# Altium schematic sheet 33.DRAM-DDR4_2x16bit_96P.SchDoc
size 420 x 297 mm
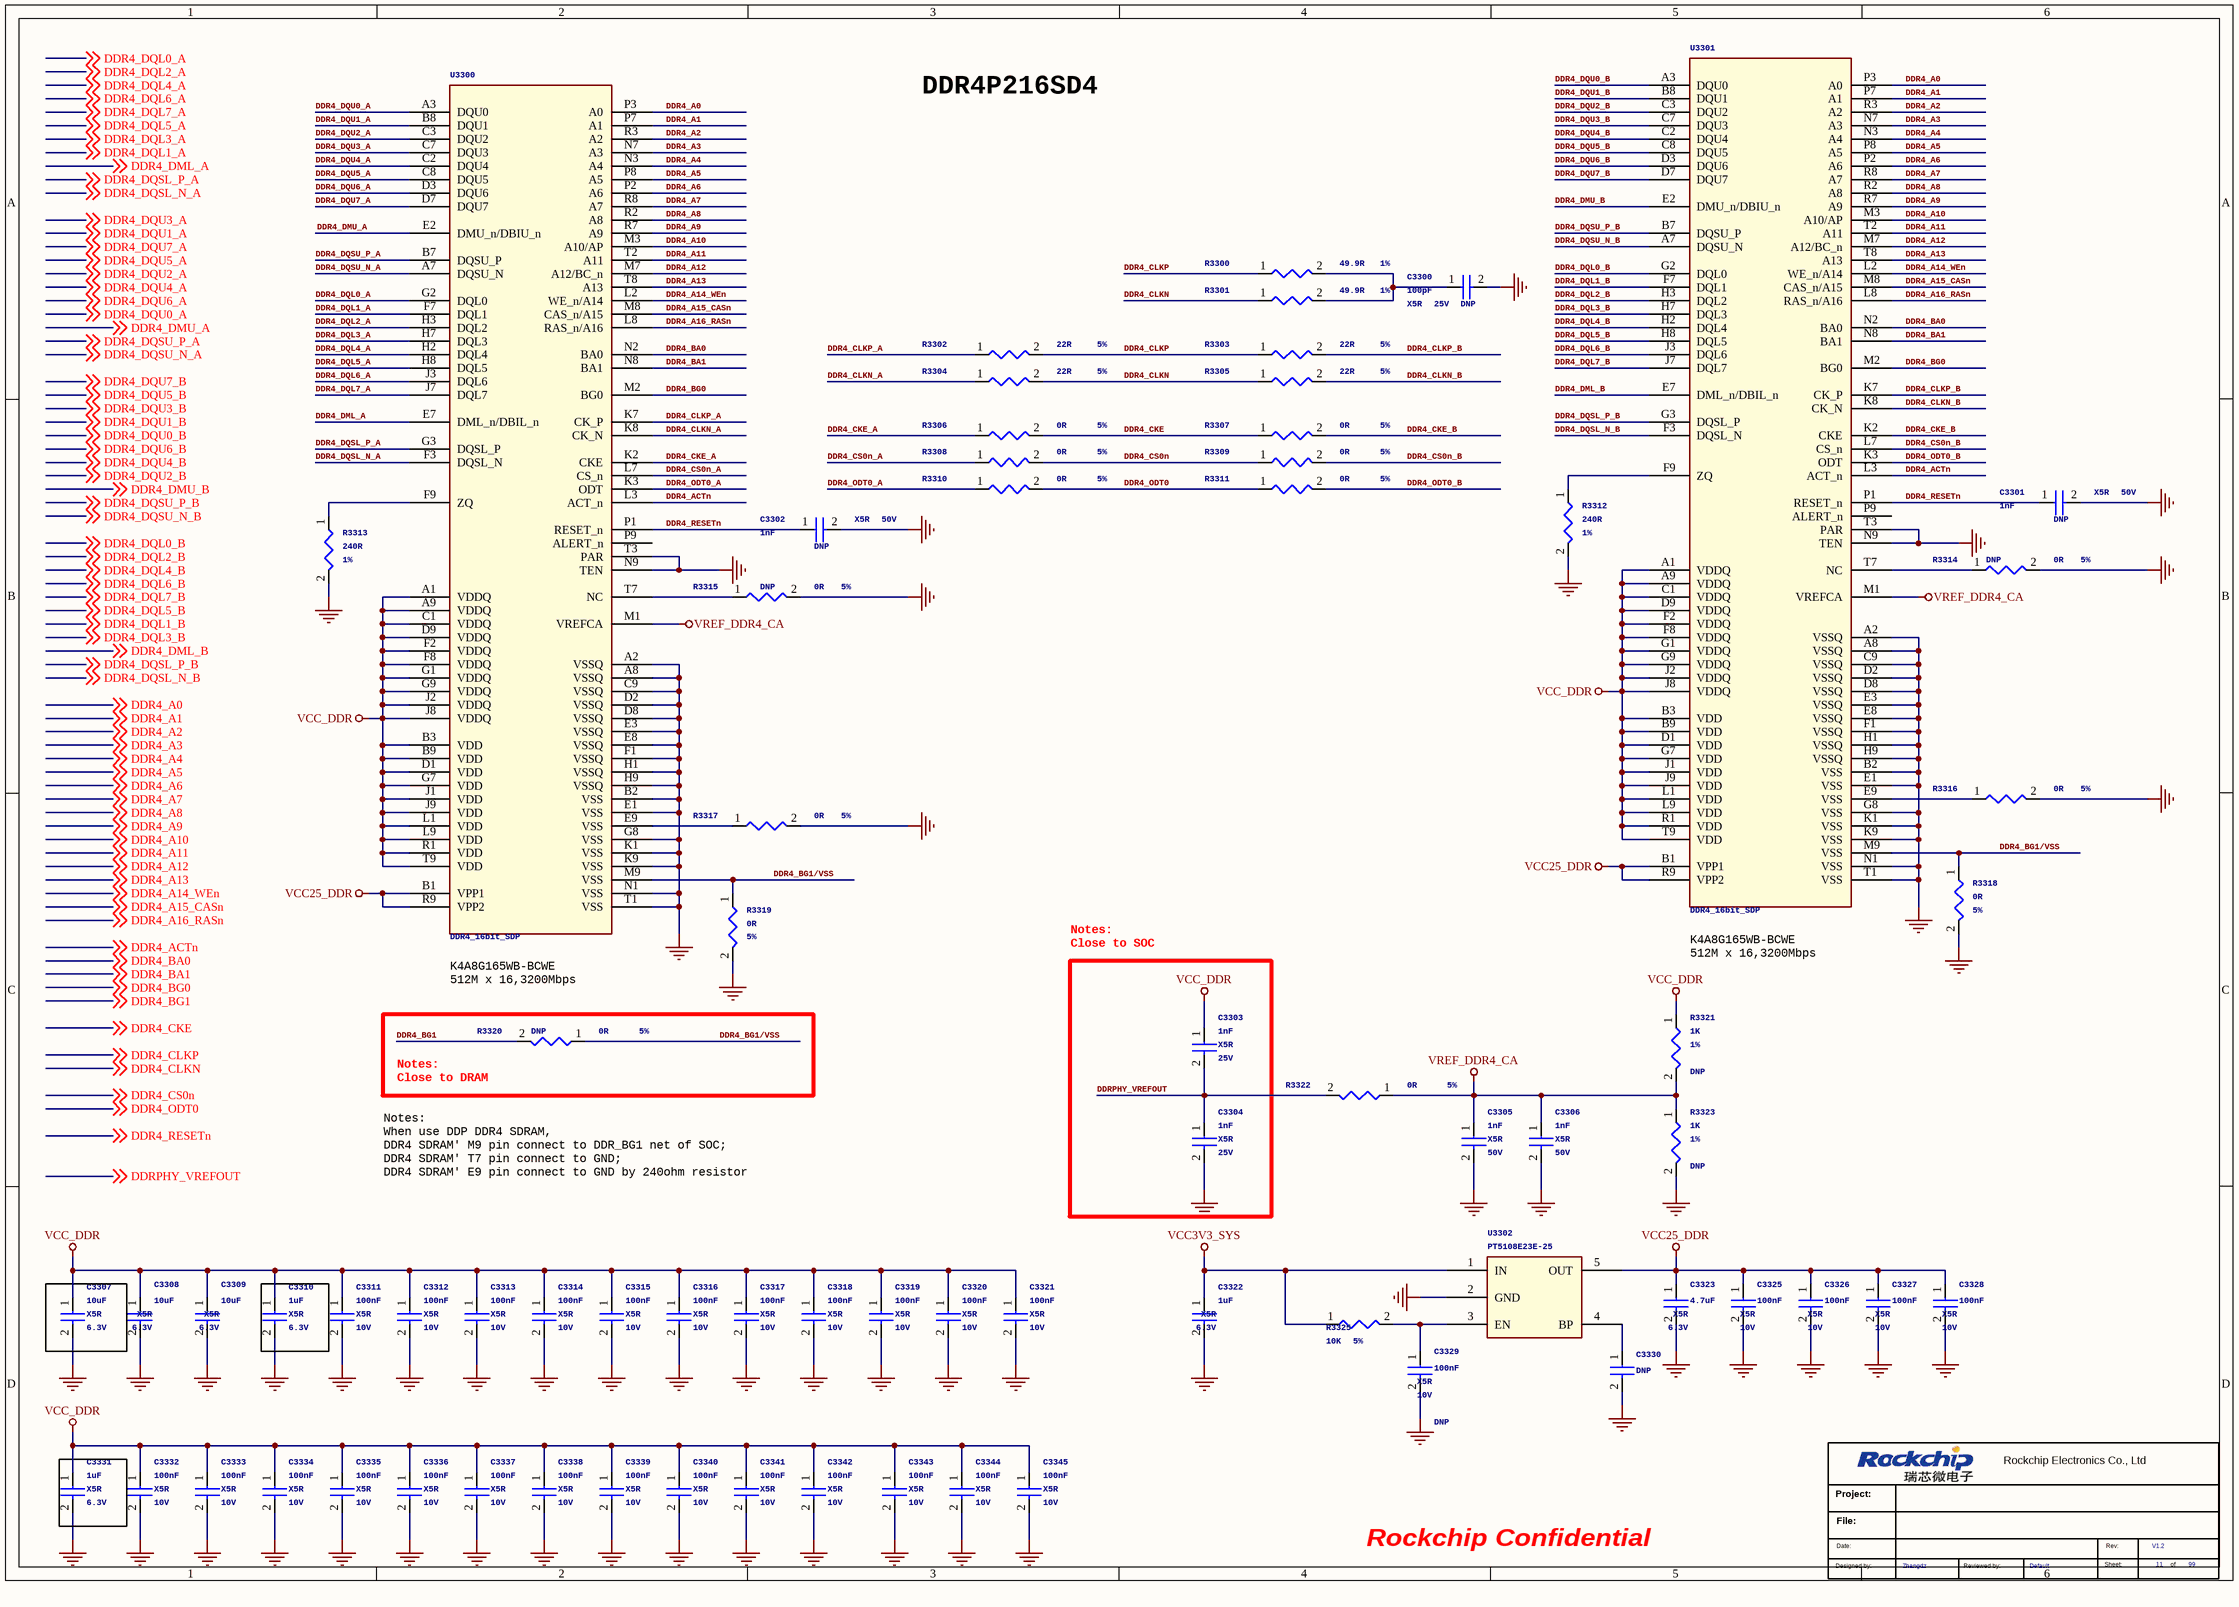
[diagram p0: 33.DRAM-DDR4_2x16bit_96P.SchDoc]

## Parts
*  Schematic Page Count: 99  Schematic Page Number: 11  Designer: Zhangdz  Revision: V1.2  Check: Default  (hidden comment: Rockchip_new)  (graphical)
C3300  100pF  Voltage: 25V  Dielectric: X5R  option: DNP  [C0201]
C3301  1nF  Voltage: 50V  Dielectric: X5R  option: DNP  [C0402]
C3302  1nF  Voltage: 50V  Dielectric: X5R  option: DNP  [C0402]
C3303  1nF  Voltage: 25V  Dielectric: X5R  [C0201]
C3304  1nF  Voltage: 25V  Dielectric: X5R  [C0201]
C3305  1nF  Voltage: 50V  Dielectric: X5R  [C0402]
C3306  1nF  Voltage: 50V  Dielectric: X5R  [C0402]
C3307  10uF  Voltage: 6.3V  Dielectric: X5R  [C0603]
C3308  10uF  Voltage: 6.3V  Dielectric: X5R  [C0603]
C3309  10uF  Voltage: 6.3V  Dielectric: X5R  [C0603]
C3310  1uF  Voltage: 6.3V  Dielectric: X5R  [C0402]
C3311  100nF  Voltage: 10V  Dielectric: X5R  [C0402]
C3312  100nF  Voltage: 10V  Dielectric: X5R  [C0402]
C3313  100nF  Voltage: 10V  Dielectric: X5R  [C0402]
C3314  100nF  Voltage: 10V  Dielectric: X5R  [C0402]
C3315  100nF  Voltage: 10V  Dielectric: X5R  [C0402]
C3316  100nF  Voltage: 10V  Dielectric: X5R  [C0402]
C3317  100nF  Voltage: 10V  Dielectric: X5R  [C0402]
C3318  100nF  Voltage: 10V  Dielectric: X5R  [C0402]
C3319  100nF  Voltage: 10V  Dielectric: X5R  [C0402]
C3320  100nF  Voltage: 10V  Dielectric: X5R  [C0402]
C3321  100nF  Voltage: 10V  Dielectric: X5R  [C0402]
C3322  1uF  Voltage: 6.3V  Dielectric: X5R  [C0402]
C3323  4.7uF  Voltage: 6.3V  Dielectric: X5R  [C0402]
C3325  100nF  Voltage: 10V  Dielectric: X5R  [C0402]
C3326  100nF  Voltage: 10V  Dielectric: X5R  [C0402]
C3327  100nF  Voltage: 10V  Dielectric: X5R  [C0402]
C3328  100nF  Voltage: 10V  Dielectric: X5R  [C0402]
C3329  100nF  Voltage: 10V  Dielectric: X5R  option: DNP  [C0402]
C3330  DNP  [C0402]
C3331  1uF  Voltage: 6.3V  Dielectric: X5R  [C0402]
C3332  100nF  Voltage: 10V  Dielectric: X5R  [C0402]
C3333  100nF  Voltage: 10V  Dielectric: X5R  [C0402]
C3334  100nF  Voltage: 10V  Dielectric: X5R  [C0402]
C3335  100nF  Voltage: 10V  Dielectric: X5R  [C0402]
C3336  100nF  Voltage: 10V  Dielectric: X5R  [C0402]
C3337  100nF  Voltage: 10V  Dielectric: X5R  [C0402]
C3338  100nF  Voltage: 10V  Dielectric: X5R  [C0402]
C3339  100nF  Voltage: 10V  Dielectric: X5R  [C0402]
C3340  100nF  Voltage: 10V  Dielectric: X5R  [C0402]
C3341  100nF  Voltage: 10V  Dielectric: X5R  [C0402]
C3342  100nF  Voltage: 10V  Dielectric: X5R  [C0402]
C3343  100nF  Voltage: 10V  Dielectric: X5R  [C0402]
C3344  100nF  Voltage: 10V  Dielectric: X5R  [C0402]
C3345  100nF  Voltage: 10V  Dielectric: X5R  [C0402]
R3300  49.9R  Tolerance: 1%  [R0201]
R3301  49.9R  Tolerance: 1%  [R0201]
R3302  22R  Tolerance: 5%  [R0201]
R3303  22R  Tolerance: 5%  [R0201]
R3304  22R  Tolerance: 5%  [R0201]
R3305  22R  Tolerance: 5%  [R0201]
R3306  0R  Tolerance: 5%  [R0201]
R3307  0R  Tolerance: 5%  [R0201]
R3308  0R  Tolerance: 5%  [R0201]
R3309  0R  Tolerance: 5%  [R0201]
R3310  0R  Tolerance: 5%  [R0201]
R3311  0R  Tolerance: 5%  [R0201]
R3312  240R  Tolerance: 1%  [R0402]
R3313  240R  Tolerance: 1%  [R0402]
R3314  0R  Tolerance: 5%  option: DNP  [R0402]
R3315  0R  Tolerance: 5%  option: DNP  [R0402]
R3316  0R  Tolerance: 5%  [R0402]
R3317  0R  Tolerance: 5%  [R0402]
R3318  0R  Tolerance: 5%  [R0402]
R3319  0R  Tolerance: 5%  [R0402]
R3320  0R  Tolerance: 5%  option: DNP  [R0402]
R3321  1K  Tolerance: 1%  option: DNP  [R0402]
R3322  0R  Tolerance: 5%  [R0402]
R3323  1K  Tolerance: 1%  option: DNP  [R0402]
R3325  10K  Tolerance: 5%  [R0402]
U3300  DDR4_16bit_SDP  [FBGA96_14R00X11R00X1R20]
U3301  DDR4_16bit_SDP  [FBGA96_14R00X11R00X1R20]
U3302  PT5108E23E-25  [SOT_23_5]

## Nets
GND: C3300.2 C3301.2 C3302.2 C3304.2 C3305.2 C3306.2 C3307.2 C3308.2 C3309.2 C3310.2 C3311.2 C3312.2 C3313.2 C3314.2 C3315.2 C3316.2 C3317.2 C3318.2 C3319.2 C3320.2 C3321.2 C3322.2 C3323.2 C3325.2 C3326.2 C3327.2 C3328.2 C3329.2 C3330.2 C3331.2 C3332.2 C3333.2 C3334.2 C3335.2 C3336.2 C3337.2 C3338.2 C3339.2 C3340.2 C3341.2 C3342.2 C3343.2 C3344.2 C3345.2 R3312.2 R3313.2 R3314.2 R3315.2 R3316.2 R3317.2 R3318.2 R3319.2 R3323.2 U3300.A2(VSSQ) U3300.A8(VSSQ) U3300.B2(VSS) U3300.C9(VSSQ) U3300.D2(VSSQ) U3300.D8(VSSQ) U3300.E1(VSS) U3300.E3(VSSQ) U3300.E8(VSSQ) U3300.F1(VSSQ) U3300.G8(VSS) U3300.H1(VSSQ) U3300.H9(VSSQ) U3300.K1(VSS) U3300.K9(VSS) U3300.N1(VSS) U3300.N9(TEN) U3300.T1(VSS) U3300.T3(PAR) U3301.A2(VSSQ) U3301.A8(VSSQ) U3301.B2(VSS) U3301.C9(VSSQ) U3301.D2(VSSQ) U3301.D8(VSSQ) U3301.E1(VSS) U3301.E3(VSSQ) U3301.E8(VSSQ) U3301.F1(VSSQ) U3301.G8(VSS) U3301.H1(VSSQ) U3301.H9(VSSQ) U3301.K1(VSS) U3301.K9(VSS) U3301.N1(VSS) U3301.N9(TEN) U3301.T1(VSS) U3301.T3(PAR) U3302.2(GND)
VCC3V3_SYS: C3322.1 R3325.1 U3302.1(IN)
VCC25_DDR: C3323.1 C3325.1 C3326.1 C3327.1 C3328.1 U3300.B1(VPP1) U3300.R9(VPP2) U3301.B1(VPP1) U3301.R9(VPP2) U3302.5(OUT)
VCC_DDR: C3303.1 C3307.1 C3308.1 C3309.1 C3310.1 C3311.1 C3312.1 C3313.1 C3314.1 C3315.1 C3316.1 C3317.1 C3318.1 C3319.1 C3320.1 C3321.1 C3331.1 C3332.1 C3333.1 C3334.1 C3335.1 C3336.1 C3337.1 C3338.1 C3339.1 C3340.1 C3341.1 C3342.1 C3343.1 C3344.1 C3345.1 R3321.1 U3300.A1(VDDQ) U3300.A9(VDDQ) U3300.B3(VDD) U3300.B9(VDD) U3300.C1(VDDQ) U3300.D1(VDD) U3300.D9(VDDQ) U3300.F2(VDDQ) U3300.F8(VDDQ) U3300.G1(VDDQ) U3300.G7(VDD) U3300.G9(VDDQ) U3300.J1(VDD) U3300.J2(VDDQ) U3300.J8(VDDQ) U3300.J9(VDD) U3300.L1(VDD) U3300.L9(VDD) U3300.R1(VDD) U3300.T9(VDD) U3301.A1(VDDQ) U3301.A9(VDDQ) U3301.B3(VDD) U3301.B9(VDD) U3301.C1(VDDQ) U3301.D1(VDD) U3301.D9(VDDQ) U3301.F2(VDDQ) U3301.F8(VDDQ) U3301.G1(VDDQ) U3301.G7(VDD) U3301.G9(VDDQ) U3301.J1(VDD) U3301.J2(VDDQ) U3301.J8(VDDQ) U3301.J9(VDD) U3301.L1(VDD) U3301.L9(VDD) U3301.R1(VDD) U3301.T9(VDD)
VREF_DDR4_CA: C3305.1 C3306.1 R3321.2 R3322.1 R3323.1 U3300.M1(VREFCA) U3301.M1(VREFCA)
DDR4_A0: U3300.P3(A0) U3301.P3(A0) ; off-sheet DDR4_A0
DDR4_A1: U3300.P7(A1) U3301.P7(A1) ; off-sheet DDR4_A1
DDR4_A2: U3300.R3(A2) U3301.R3(A2) ; off-sheet DDR4_A2
DDR4_A3: U3300.N7(A3) U3301.N7(A3) ; off-sheet DDR4_A3
DDR4_A4: U3300.N3(A4) U3301.N3(A4) ; off-sheet DDR4_A4
DDR4_A5: U3300.P8(A5) U3301.P8(A5) ; off-sheet DDR4_A5
DDR4_A6: U3300.P2(A6) U3301.P2(A6) ; off-sheet DDR4_A6
DDR4_A7: U3300.R8(A7) U3301.R8(A7) ; off-sheet DDR4_A7
DDR4_A8: U3300.R2(A8) U3301.R2(A8) ; off-sheet DDR4_A8
DDR4_A9: U3300.R7(A9) U3301.R7(A9) ; off-sheet DDR4_A9
DDR4_A10: U3300.M3(A10/AP) U3301.M3(A10/AP) ; off-sheet DDR4_A10
DDR4_A11: U3300.T2(A11) U3301.T2(A11) ; off-sheet DDR4_A11
DDR4_A12: U3300.M7(A12/BC_n) U3301.M7(A12/BC_n) ; off-sheet DDR4_A12
DDR4_A13: U3300.T8(A13) U3301.T8(A13) ; off-sheet DDR4_A13
DDR4_A14_WEn: U3300.L2(WE_n/A14) U3301.L2(WE_n/A14) ; off-sheet DDR4_A14_WEn
DDR4_A15_CASn: U3300.M8(CAS_n/A15) U3301.M8(CAS_n/A15) ; off-sheet DDR4_A15_CASn
DDR4_A16_RASn: U3300.L8(RAS_n/A16) U3301.L8(RAS_n/A16) ; off-sheet DDR4_A16_RASn
DDR4_ACTn: U3300.L3(ACT_n) U3301.L3(ACT_n) ; off-sheet DDR4_ACTn
DDR4_BA0: U3300.N2(BA0) U3301.N2(BA0) ; off-sheet DDR4_BA0
DDR4_BA1: U3300.N8(BA1) U3301.N8(BA1) ; off-sheet DDR4_BA1
DDR4_BG0: U3300.M2(BG0) U3301.M2(BG0) ; off-sheet DDR4_BG0
DDR4_BG1: R3320.2 ; off-sheet DDR4_BG1
DDR4_BG1/VSS: R3318.1 R3319.1 R3320.1 U3300.M9(VSS) U3301.M9(VSS)
DDR4_CKE: R3306.2 R3307.1 ; off-sheet DDR4_CKE
DDR4_CKE_A: R3306.1 U3300.K2(CKE)
DDR4_CKE_B: R3307.2 U3301.K2(CKE)
DDR4_CLKN: R3301.1 R3304.2 R3305.1 ; off-sheet DDR4_CLKN
DDR4_CLKN_A: R3304.1 U3300.K8(CK_N)
DDR4_CLKN_B: R3305.2 U3301.K8(CK_N)
DDR4_CLKP: R3300.1 R3302.2 R3303.1 ; off-sheet DDR4_CLKP
DDR4_CLKP_A: R3302.1 U3300.K7(CK_P)
DDR4_CLKP_B: R3303.2 U3301.K7(CK_P)
DDR4_CS0n: R3308.2 R3309.1 ; off-sheet DDR4_CS0n
DDR4_CS0n_A: R3308.1 U3300.L7(CS_n)
DDR4_CS0n_B: R3309.2 U3301.L7(CS_n)
DDR4_DML_A: U3300.E7(DML_n/DBIL_n) ; off-sheet DDR4_DML_A
DDR4_DML_B: U3301.E7(DML_n/DBIL_n) ; off-sheet DDR4_DML_B
DDR4_DMU_A: U3300.E2(DMU_n/DBIU_n) ; off-sheet DDR4_DMU_A
DDR4_DMU_B: U3301.E2(DMU_n/DBIU_n) ; off-sheet DDR4_DMU_B
DDR4_DQL0_A: U3300.G2(DQL0) ; off-sheet DDR4_DQL0_A
DDR4_DQL0_B: U3301.G2(DQL0) ; off-sheet DDR4_DQL0_B
DDR4_DQL1_A: U3300.F7(DQL1) ; off-sheet DDR4_DQL1_A
DDR4_DQL1_B: U3301.F7(DQL1) ; off-sheet DDR4_DQL1_B
DDR4_DQL2_A: U3300.H3(DQL2) ; off-sheet DDR4_DQL2_A
DDR4_DQL2_B: U3301.H3(DQL2) ; off-sheet DDR4_DQL2_B
DDR4_DQL3_A: U3300.H7(DQL3) ; off-sheet DDR4_DQL3_A
DDR4_DQL3_B: U3301.H7(DQL3) ; off-sheet DDR4_DQL3_B
DDR4_DQL4_A: U3300.H2(DQL4) ; off-sheet DDR4_DQL4_A
DDR4_DQL4_B: U3301.H2(DQL4) ; off-sheet DDR4_DQL4_B
DDR4_DQL5_A: U3300.H8(DQL5) ; off-sheet DDR4_DQL5_A
DDR4_DQL5_B: U3301.H8(DQL5) ; off-sheet DDR4_DQL5_B
DDR4_DQL6_A: U3300.J3(DQL6) ; off-sheet DDR4_DQL6_A
DDR4_DQL6_B: U3301.J3(DQL6) ; off-sheet DDR4_DQL6_B
DDR4_DQL7_A: U3300.J7(DQL7) ; off-sheet DDR4_DQL7_A
DDR4_DQL7_B: U3301.J7(DQL7) ; off-sheet DDR4_DQL7_B
DDR4_DQSL_N_A: U3300.F3(DQSL_N) ; off-sheet DDR4_DQSL_N_A
DDR4_DQSL_N_B: U3301.F3(DQSL_N) ; off-sheet DDR4_DQSL_N_B
DDR4_DQSL_P_A: U3300.G3(DQSL_P) ; off-sheet DDR4_DQSL_P_A
DDR4_DQSL_P_B: U3301.G3(DQSL_P) ; off-sheet DDR4_DQSL_P_B
DDR4_DQSU_N_A: U3300.A7(DQSU_N) ; off-sheet DDR4_DQSU_N_A
DDR4_DQSU_N_B: U3301.A7(DQSU_N) ; off-sheet DDR4_DQSU_N_B
DDR4_DQSU_P_A: U3300.B7(DQSU_P) ; off-sheet DDR4_DQSU_P_A
DDR4_DQSU_P_B: U3301.B7(DQSU_P) ; off-sheet DDR4_DQSU_P_B
DDR4_DQU0_A: U3300.A3(DQU0) ; off-sheet DDR4_DQU0_A
DDR4_DQU0_B: U3301.A3(DQU0) ; off-sheet DDR4_DQU0_B
DDR4_DQU1_A: U3300.B8(DQU1) ; off-sheet DDR4_DQU1_A
DDR4_DQU1_B: U3301.B8(DQU1) ; off-sheet DDR4_DQU1_B
DDR4_DQU2_A: U3300.C3(DQU2) ; off-sheet DDR4_DQU2_A
DDR4_DQU2_B: U3301.C3(DQU2) ; off-sheet DDR4_DQU2_B
DDR4_DQU3_A: U3300.C7(DQU3) ; off-sheet DDR4_DQU3_A
DDR4_DQU3_B: U3301.C7(DQU3) ; off-sheet DDR4_DQU3_B
DDR4_DQU4_A: U3300.C2(DQU4) ; off-sheet DDR4_DQU4_A
DDR4_DQU4_B: U3301.C2(DQU4) ; off-sheet DDR4_DQU4_B
DDR4_DQU5_A: U3300.C8(DQU5) ; off-sheet DDR4_DQU5_A
DDR4_DQU5_B: U3301.C8(DQU5) ; off-sheet DDR4_DQU5_B
DDR4_DQU6_A: U3300.D3(DQU6) ; off-sheet DDR4_DQU6_A
DDR4_DQU6_B: U3301.D3(DQU6) ; off-sheet DDR4_DQU6_B
DDR4_DQU7_A: U3300.D7(DQU7) ; off-sheet DDR4_DQU7_A
DDR4_DQU7_B: U3301.D7(DQU7) ; off-sheet DDR4_DQU7_B
DDR4_ODT0: R3310.2 R3311.1 ; off-sheet DDR4_ODT0
DDR4_ODT0_A: R3310.1 U3300.K3(ODT)
DDR4_ODT0_B: R3311.2 U3301.K3(ODT)
DDR4_RESETn: C3301.1 C3302.1 U3300.P1(RESET_n) U3301.P1(RESET_n) ; off-sheet DDR4_RESETn
DDRPHY_VREFOUT: C3303.2 C3304.1 R3322.2 ; off-sheet DDRPHY_VREFOUT
NetC3300_1: C3300.1 R3300.2 R3301.2
NetC3329_1: C3329.1 R3325.2 U3302.3(EN)
NetC3330_1: C3330.1 U3302.4(BP)
NetR3312_1: R3312.1 U3301.F9(ZQ)
NetR3313_1: R3313.1 U3300.F9(ZQ)
NetR3314_1: R3314.1 U3301.T7(NC)
NetR3315_1: R3315.1 U3300.T7(NC)
NetR3316_1: R3316.1 U3301.E9(VSS)
NetR3317_1: R3317.1 U3300.E9(VSS)

Not connected (* = marked no-connect by the designer): U3300 P9(ALERT_n); U3301 P9(ALERT_n)

## Notes on the sheet
- DDR4P216SD4
- K4A8G165WB-BCWE
- 512M x 16,3200Mbps
- Notes:
  Close to SOC
- (near R3320) Notes:
  Close to DRAM
- Notes:
  When use DDP DDR4 SDRAM,
  DDR4 SDRAM' M9 pin connect to DDR_BG1 net of SOC;
  DDR4 SDRAM' T7 pin connect to GND;
  DDR4 SDRAM' E9 pin connect to GND by 240ohm resistor
- Rockchip Confidential
- (in symbol Rockchip_new) Rockchip Electronics Co., Ltd; Project:; File:; Date:; Rev:; Sheet:; of; Designed by:; Reviewed by:

## Library data of the parts
* = Rockchip_new: Page Number: 22; Page Count: 37; Revcode: V1.2
C3300 = CAP NP: cap,100.00pF,+/-10%,25V,X5R,C0201; Manufacturer PN: C0603X5R1E101K030BA; Manufacturer: TDK; C_Voltage: 6.3V; Tolerance: 10%; Priority: A; Number: 37; Created by: JJJ; Part Type: C0201; RK PN: C0603X5R1E101K030BA
C3301 C3302 C3305 = CAP NP: cap,1.00nF,+/-10%,50V,X5R,C0402; Manufacturer PN: C1005X5R1H102K050BA; Manufacturer: TDK; C_Voltage: 6.3V; Tolerance: 10%; Priority: A; Number: 37; Created by: JJJ; Part Type: C0402; RK PN: C1005X5R1H102K050BA
C3303 = CAP NP: cap,1.00nF,+/-10%,25V,X5R,C0201; Manufacturer PN: C0603X5R1E102K030BA; Manufacturer: TDK; C_Voltage: 6.3V; Tolerance: 10%; Priority: A; Number: 37; Created by: JJJ; Part Type: C0201; RK PN: C0603X5R1E102K030BA
C3304 = CAP NP: cap,1.00nF,+/-10%,25V,X5R,C0201; Manufacturer: TDK; Number: 37; RK PN: C0603X5R1E102K030BA; Priority: A; Tolerance: 10%; C_Voltage: 6.3V; Part Type: C0201; Manufacturer PN: C0603X5R1E102K030BA; Created by: JJJ
C3306 = CAP NP: cap,1.00nF,+/-10%,50V,X5R,C0402; Manufacturer: TDK; Number: 37; RK PN: C1005X5R1H102K050BA; Priority: A; Tolerance: 10%; C_Voltage: 6.3V; Part Type: C0402; Manufacturer PN: C1005X5R1H102K050BA; Created by: JJJ
C3307 C3308 = CAP NP: cap,10.00uF,+/-10%,6.3V,X5R,C0603; Manufacturer: TDK; RK PN: C1608X5R0J106K080AB; Priority: A; Tolerance: 10%; Part Type: C0603; C_Voltage: 6.3V; Manufacturer PN: C1608X5R0J106K080AB; Created by: JJJ
C3309 = CAP NP: cap,10.00uF,+/-10%,6.3V,X5R,C0603; Manufacturer PN: C1608X5R0J106K080AB; Manufacturer: TDK; Tolerance: 10%; Priority: A; Created by: JJJ; C_Voltage: 6.3V; Part Type: C0603; RK PN: C1608X5R0J106K080AB
C3310 C3331 = CAP NP: cap,1.00uF,+/-10%,6.3V,X5R,C0402; Manufacturer: TDK; Number: 37; RK PN: C1005X5R0J105K050BB; Priority: A; Tolerance: 10%; Part Type: C0402; Manufacturer PN: C1005X5R0J105K050BB; C_Voltage: 6.3V; Created by: JJJ
C3311 C3313-C3315 C3317 C3320 C3327 C3329 C3333 C3334 C3336 C3339 C3341 C3343 C3344 = CAP NP: cap,100.00nF,+/-10%,10V,X5R,C0402; Manufacturer PN: C1005X5R1A104K050BA; Manufacturer: TDK; C_Voltage: 6.3V; Tolerance: 10%; Priority: A; Number: 37; Created by: JJJ; Part Type: C0402; RK PN: C1005X5R1A104K050BA
C3312 C3316 C3318 C3319 C3321 C3325 C3326 C3328 C3332 C3335 C3337 C3338 C3340 C3342 C3345 = CAP NP: cap,100.00nF,+/-10%,10V,X5R,C0402; Manufacturer: TDK; Number: 37; RK PN: C1005X5R1A104K050BA; Priority: A; Tolerance: 10%; C_Voltage: 6.3V; Part Type: C0402; Manufacturer PN: C1005X5R1A104K050BA; Created by: JJJ
C3322 = CAP NP: cap,1.00uF,+/-10%,6.3V,X5R,C0402; Manufacturer PN: C1005X5R0J105K050BB; Manufacturer: TDK; Tolerance: 10%; Priority: A; Created by: JJJ; C_Voltage: 6.3V; Part Type: C0402; RK PN: C1005X5R0J105K050BB
C3323 = CAP NP: cap,4.70uF,+/-10%,6.3V,X5R,C0402; Manufacturer PN: C1005X5R0J475K050BC; Manufacturer: TDK; Tolerance: 10%; Priority: A; Number: 37; Created by: JJJ; C_Voltage: 6.3V; Part Type: C0402; RK PN: C1005X5R0J475K050BC
C3330 = CAP NP: Did Not Place.; RK PN: DNP0402; Priority: A; Part Type: DNP; Manufacturer PN: DNP0402; Created by: JJJ
R3300 = RESISTOR: 通用厚膜电阻,49R9,+/-1%,R0201,1/20W.; Manufacturer: YAGEO; RK PN: RC0201FR-0749R9L; Priority: A; Wattage: 1/20W; Part Type: 通用厚膜电阻; Manufacturer PN: RC0201FR-0749R9L; Created by: YTL
R3301 = RESISTOR: 通用厚膜电阻,49R9,+/-1%,R0201,1/20W.; Manufacturer PN: RC0201FR-0749R9L; Manufacturer: YAGEO; Wattage: 1/20W; Priority: A; Created by: YTL; Part Type: 通用厚膜电阻; RK PN: RC0201FR-0749R9L
R3302 R3303 = RESISTOR: 通用厚膜电阻,22R,+/-5%,R0201,1/20W.; Manufacturer PN: RC0201JR-0722RL; Manufacturer: YAGEO; Wattage: 1/20W; Priority: A; Created by: YTL; Part Type: 通用厚膜电阻; RK PN: RC0201JR-0722RL
R3304 R3305 = RESISTOR: 通用厚膜电阻,22R,+/-5%,R0201,1/20W.; Manufacturer: YAGEO; RK PN: RC0201JR-0722RL; Priority: A; Wattage: 1/20W; Part Type: 通用厚膜电阻; Manufacturer PN: RC0201JR-0722RL; Created by: YTL
R3306-R3311 = RESISTOR: 通用厚膜电阻,0R,+/-5%,R0201,1/20W.; Manufacturer: YAGEO; RK PN: RC0201JR-070RL; Priority: A; Wattage: 1/20W; Part Type: 通用厚膜电阻; Manufacturer PN: RC0201JR-070RL; Created by: YTL
R3312 = RESISTOR: 通用厚膜电阻,240R,+/-1%,R0402,1/16W.; Manufacturer PN: RC0402FR-07240RL; Manufacturer: YAGEO; Wattage: 1/16W; Priority: A; Created by: YTL; Part Type: 通用厚膜电阻; RK PN: RC0402FR-07240RL
R3313 = RESISTOR: 通用厚膜电阻,240R,+/-1%,R0402,1/16W.; Manufacturer: YAGEO; RK PN: RC0402FR-07240RL; Priority: A; Wattage: 1/16W; Part Type: 通用厚膜电阻; Manufacturer PN: RC0402FR-07240RL; Created by: YTL
R3314 R3317 R3319 = RESISTOR: 通用厚膜电阻,0R,+/-5%,R0402,1/16W.; Manufacturer PN: RC0402JR-070RL; Manufacturer: YAGEO; Wattage: 1/16W; Priority: A; Created by: YTL; Part Type: 通用厚膜电阻; RK PN: RC0402JR-070RL
R3315 R3316 R3318 R3320 R3322 = RESISTOR: 通用厚膜电阻,0R,+/-5%,R0402,1/16W.; Manufacturer: YAGEO; RK PN: RC0402JR-070RL; Priority: A; Wattage: 1/16W; Part Type: 通用厚膜电阻; Manufacturer PN: RC0402JR-070RL; Created by: YTL
R3321 = RESISTOR: 通用厚膜电阻,1K,+/-1%,R0402,1/16W.; Manufacturer PN: RC0402FR-071KL; Manufacturer: YAGEO; Wattage: 1/16W; Priority: A; Created by: YTL; Part Type: 通用厚膜电阻; RK PN: RC0402FR-071KL
R3323 = RESISTOR: 通用厚膜电阻,1K,+/-1%,R0402,1/16W.; Manufacturer: YAGEO; RK PN: RC0402FR-071KL; Priority: A; Wattage: 1/16W; Part Type: 通用厚膜电阻; Manufacturer PN: RC0402FR-071KL; Created by: YTL
R3325 = RESISTOR: 通用厚膜电阻,10K,+/-5%,R0402,1/16W.; Manufacturer PN: RC0402JR-0710KL; Manufacturer: YAGEO; Wattage: 1/16W; Priority: A; Created by: YTL; Part Type: 通用厚膜电阻; RK PN: RC0402JR-0710KL
U3300 U3301 = DDR4_16bit: DDR4，16bit,96ball FBGA; Manufacturer: DRAM; Priority: A; RK PN: DDR4_16bit; Part Type: DRAM; Manufacturer PN: DDR4_16bit; Created by: JJJ
U3302 = LDO_PT5108: High-PSRR 500mA LDO.Output2.5V.; Manufacturer PN: PT5108E23E-12; Manufacturer: Powtech（华润矽威）; Priority: A; Created by: JJJ; Part Type: LDO; RK PN: PT5108E23E-25